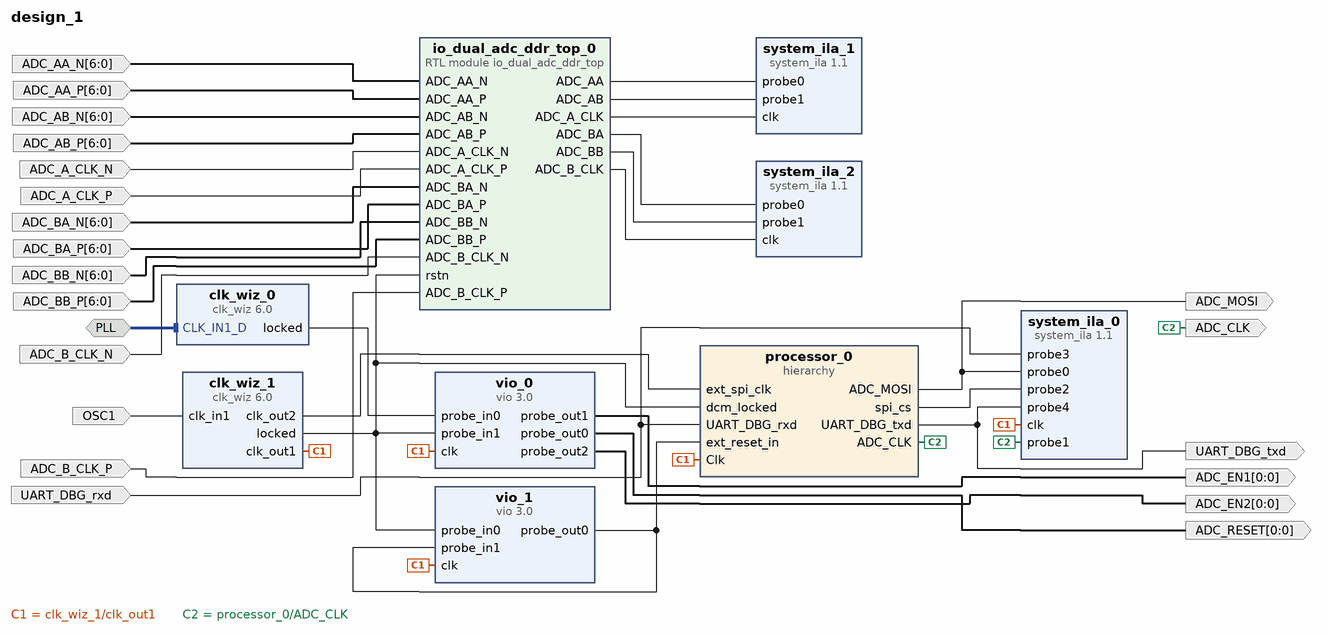
[diagram p0: block diagram of the top level]
# Vivado block design design_1, xcau10p-ffvb676-2-i, Vivado 2024.2
create_bd_design design_1

create_bd_intf_port -mode Slave -vlnv xilinx.com:interface:diff_clock_rtl:1.0 PLL
create_bd_port -dir O ADC_MOSI
create_bd_port -dir O ADC_CLK
create_bd_port -dir O -from 0 -to 0 ADC_RESET
create_bd_port -dir O -from 0 -to 0 ADC_EN1
create_bd_port -dir O -from 0 -to 0 ADC_EN2
create_bd_port -dir I -type clk OSC1
create_bd_port -dir I -from 6 -to 0 ADC_AA_N
create_bd_port -dir I -from 6 -to 0 ADC_AA_P
create_bd_port -dir I -from 6 -to 0 ADC_AB_N
create_bd_port -dir I -from 6 -to 0 ADC_AB_P
create_bd_port -dir I -type clk ADC_A_CLK_N
create_bd_port -dir I -type clk ADC_A_CLK_P
create_bd_port -dir I -from 6 -to 0 ADC_BA_N
create_bd_port -dir I -from 6 -to 0 ADC_BA_P
create_bd_port -dir I -from 6 -to 0 ADC_BB_N
create_bd_port -dir I -from 6 -to 0 ADC_BB_P
create_bd_port -dir I -type clk ADC_B_CLK_N
create_bd_port -dir I -type clk ADC_B_CLK_P
create_bd_port -dir I UART_DBG_rxd
create_bd_port -dir O UART_DBG_txd

create_bd_cell -type ip -vlnv xilinx.com:ip:system_ila:1.1 system_ila_0
set_property -dict [list \
  CONFIG.C_DATA_DEPTH 16384 \
  CONFIG.C_INPUT_PIPE_STAGES 2 \
  CONFIG.C_MON_TYPE NATIVE \
  CONFIG.C_NUM_OF_PROBES 5 \
] [get_bd_cells system_ila_0]
create_bd_cell -type ip -vlnv xilinx.com:ip:vio:3.0 vio_0
set_property -dict {CONFIG.C_NUM_PROBE_IN 2 CONFIG.C_NUM_PROBE_OUT 3} [get_bd_cells vio_0]
create_bd_cell -type ip -vlnv xilinx.com:ip:clk_wiz:6.0 clk_wiz_0
set_property -dict [list \
  CONFIG.CLKOUT1_DRIVES BUFG \
  CONFIG.CLKOUT1_JITTER 120.663 \
  CONFIG.CLKOUT1_REQUESTED_OUT_FREQ 80.000 \
  CONFIG.CLKOUT2_DRIVES BUFG \
  CONFIG.CLKOUT2_JITTER 139.033 \
  CONFIG.CLKOUT2_PHASE_ERROR 87.180 \
  CONFIG.CLKOUT2_REQUESTED_OUT_FREQ 40.000 \
  CONFIG.CLKOUT2_USED true \
  CONFIG.CLKOUT3_DRIVES BUFG \
  CONFIG.CLKOUT3_JITTER 162.167 \
  CONFIG.CLKOUT3_PHASE_ERROR 87.180 \
  CONFIG.CLKOUT3_REQUESTED_OUT_FREQ 20.000 \
  CONFIG.CLKOUT3_USED true \
  CONFIG.CLKOUT4_DRIVES BUFG \
  CONFIG.CLKOUT4_JITTER 162.167 \
  CONFIG.CLKOUT4_PHASE_ERROR 87.180 \
  CONFIG.CLKOUT4_REQUESTED_OUT_FREQ 20.000 \
  CONFIG.CLKOUT4_REQUESTED_PHASE 180.000 \
  CONFIG.CLKOUT4_USED true \
  CONFIG.CLK_OUT1_PORT clk_80 \
  CONFIG.CLK_OUT2_PORT clk_40 \
  CONFIG.CLK_OUT3_PORT clk_20 \
  CONFIG.CLK_OUT4_PORT clk_20n \
  CONFIG.FEEDBACK_SOURCE FDBK_AUTO \
  CONFIG.MMCM_CLKOUT0_DIVIDE_F 15.000 \
  CONFIG.MMCM_CLKOUT1_DIVIDE 30 \
  CONFIG.MMCM_CLKOUT2_DIVIDE 60 \
  CONFIG.MMCM_CLKOUT3_DIVIDE 60 \
  CONFIG.MMCM_CLKOUT3_PHASE 180.000 \
  CONFIG.NUM_OUT_CLKS 4 \
  CONFIG.PRIM_SOURCE Differential_clock_capable_pin \
  CONFIG.USE_RESET false \
] [get_bd_cells clk_wiz_0]
create_bd_cell -type hier processor_0
create_bd_cell -type module -reference io_dual_adc_ddr_top io_dual_adc_ddr_top_0
create_bd_cell -type ip -vlnv xilinx.com:ip:system_ila:1.1 system_ila_1
set_property -dict {CONFIG.C_DATA_DEPTH 8192 CONFIG.C_MON_TYPE NATIVE CONFIG.C_NUM_OF_PROBES 2} [get_bd_cells system_ila_1]
create_bd_cell -type ip -vlnv xilinx.com:ip:system_ila:1.1 system_ila_2
set_property -dict {CONFIG.C_DATA_DEPTH 8192 CONFIG.C_MON_TYPE NATIVE CONFIG.C_NUM_OF_PROBES 2} [get_bd_cells system_ila_2]
create_bd_cell -type ip -vlnv xilinx.com:ip:clk_wiz:6.0 clk_wiz_1
set_property -dict [list \
  CONFIG.AUTO_PRIMITIVE PLL \
  CONFIG.CLKOUT1_DRIVES BUFG \
  CONFIG.CLKOUT1_JITTER 144.719 \
  CONFIG.CLKOUT1_PHASE_ERROR 114.212 \
  CONFIG.CLKOUT2_DRIVES BUFG \
  CONFIG.CLKOUT2_JITTER 239.501 \
  CONFIG.CLKOUT2_PHASE_ERROR 114.212 \
  CONFIG.CLKOUT2_REQUESTED_OUT_FREQ 8.000 \
  CONFIG.CLKOUT2_USED true \
  CONFIG.CLKOUT3_DRIVES Buffer \
  CONFIG.CLKOUT4_DRIVES Buffer \
  CONFIG.CLKOUT5_DRIVES Buffer \
  CONFIG.CLKOUT6_DRIVES Buffer \
  CONFIG.CLKOUT7_DRIVES Buffer \
  CONFIG.FEEDBACK_SOURCE FDBK_AUTO \
  CONFIG.MMCM_BANDWIDTH OPTIMIZED \
  CONFIG.MMCM_CLKFBOUT_MULT_F 8 \
  CONFIG.MMCM_CLKOUT0_DIVIDE_F 8 \
  CONFIG.MMCM_CLKOUT1_DIVIDE 100 \
  CONFIG.MMCM_COMPENSATION AUTO \
  CONFIG.NUM_OUT_CLKS 2 \
  CONFIG.OPTIMIZE_CLOCKING_STRUCTURE_EN true \
  CONFIG.PRIMITIVE PLL \
  CONFIG.USE_LOCKED true \
  CONFIG.USE_RESET false \
] [get_bd_cells clk_wiz_1]
create_bd_cell -type ip -vlnv xilinx.com:ip:vio:3.0 vio_1
set_property -dict {CONFIG.C_NUM_PROBE_IN 2} [get_bd_cells vio_1]

# ---- hierarchy /processor_0 ----
current_bd_instance /processor_0
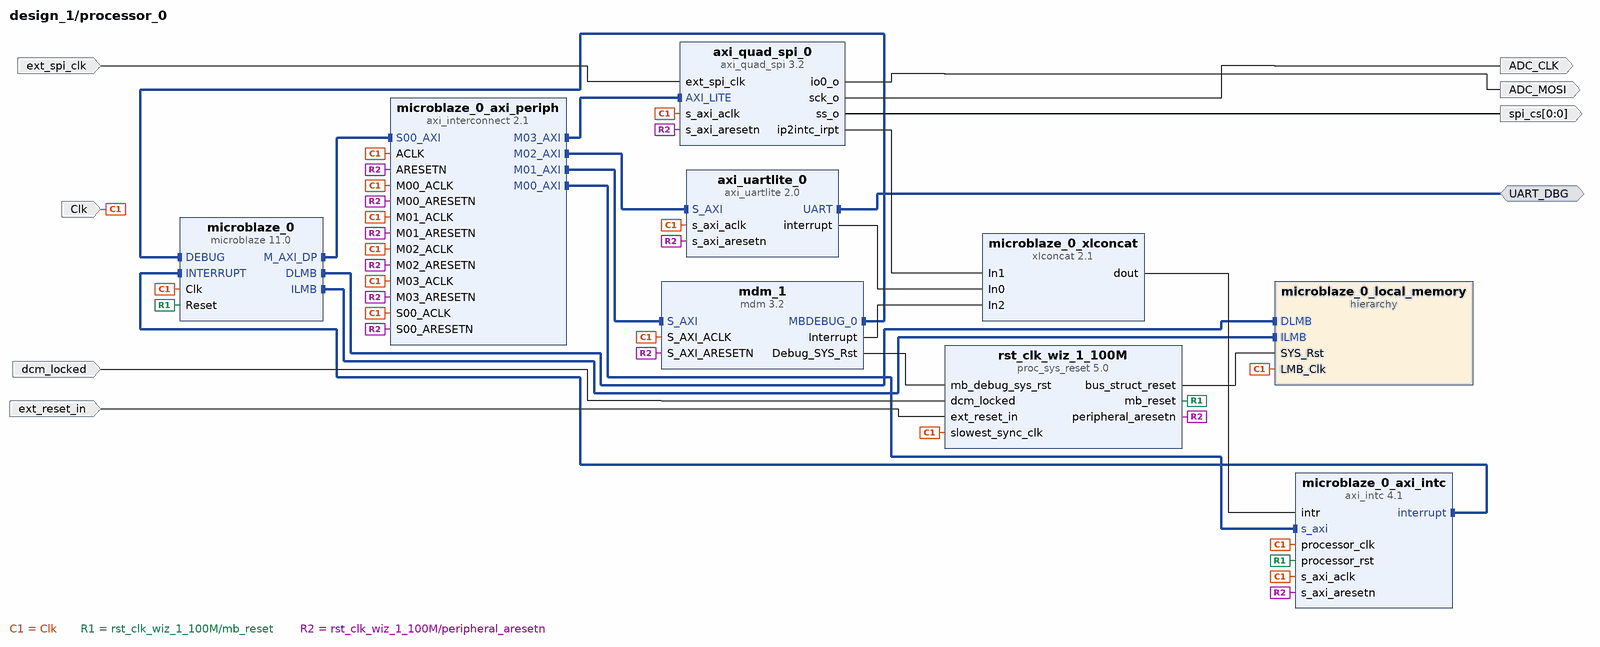
[diagram p1: block diagram inside /processor_0]
create_bd_intf_pin -mode Master -vlnv xilinx.com:interface:uart_rtl:1.0 UART_DBG
create_bd_pin -dir I -type clk Clk
create_bd_pin -dir I dcm_locked
create_bd_pin -dir I -type clk ext_spi_clk
create_bd_pin -dir O ADC_MOSI
create_bd_pin -dir O ADC_CLK
create_bd_pin -dir O -from 0 -to 0 spi_cs
create_bd_pin -dir I -type rst ext_reset_in

create_bd_cell -type ip -vlnv xilinx.com:ip:mdm:3.2 mdm_1
set_property -dict {CONFIG.C_ADDR_SIZE 32 CONFIG.C_M_AXI_ADDR_WIDTH 32 CONFIG.C_USE_UART 1} [get_bd_cells mdm_1]
create_bd_cell -type ip -vlnv xilinx.com:ip:axi_intc:4.1 microblaze_0_axi_intc
set_property -dict {CONFIG.C_HAS_FAST 1} [get_bd_cells microblaze_0_axi_intc]
create_bd_cell -type ip -vlnv xilinx.com:ip:xlconcat:2.1 microblaze_0_xlconcat
set_property -dict {CONFIG.NUM_PORTS 3} [get_bd_cells microblaze_0_xlconcat]
create_bd_cell -type ip -vlnv xilinx.com:ip:microblaze:11.0 microblaze_0
set_property -dict [list \
  CONFIG.C_DEBUG_ENABLED 1 \
  CONFIG.C_D_AXI 1 \
  CONFIG.C_D_LMB 1 \
  CONFIG.C_ENABLE_CONVERSION 0 \
  CONFIG.C_I_LMB 1 \
  CONFIG.G_TEMPLATE_LIST 8 \
] [get_bd_cells microblaze_0]
create_bd_cell -type ip -vlnv xilinx.com:ip:axi_uartlite:2.0 axi_uartlite_0
create_bd_cell -type ip -vlnv xilinx.com:ip:proc_sys_reset:5.0 rst_clk_wiz_1_100M
create_bd_cell -type ip -vlnv xilinx.com:ip:axi_quad_spi:3.2 axi_quad_spi_0
create_bd_cell -type ip -vlnv xilinx.com:ip:axi_interconnect:2.1 microblaze_0_axi_periph
set_property -dict {CONFIG.NUM_MI 4} [get_bd_cells microblaze_0_axi_periph]
create_bd_cell -type hier microblaze_0_local_memory

# ---- hierarchy /processor_0/microblaze_0_local_memory ----
current_bd_instance /processor_0/microblaze_0_local_memory
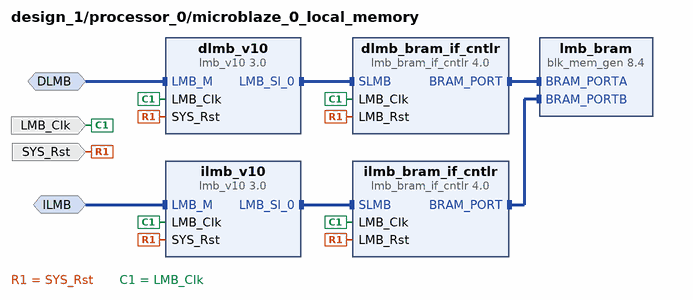
[diagram p2: block diagram inside /processor_0/microblaze_0_local_memory]
create_bd_intf_pin -mode MirroredMaster -vlnv xilinx.com:interface:lmb_rtl:1.0 DLMB
create_bd_intf_pin -mode MirroredMaster -vlnv xilinx.com:interface:lmb_rtl:1.0 ILMB
create_bd_pin -dir I -type clk LMB_Clk
create_bd_pin -dir I -type rst SYS_Rst

create_bd_cell -type ip -vlnv xilinx.com:ip:lmb_v10:3.0 dlmb_v10
create_bd_cell -type ip -vlnv xilinx.com:ip:lmb_v10:3.0 ilmb_v10
create_bd_cell -type ip -vlnv xilinx.com:ip:lmb_bram_if_cntlr:4.0 dlmb_bram_if_cntlr
set_property -dict {CONFIG.C_ECC 0} [get_bd_cells dlmb_bram_if_cntlr]
create_bd_cell -type ip -vlnv xilinx.com:ip:lmb_bram_if_cntlr:4.0 ilmb_bram_if_cntlr
set_property -dict {CONFIG.C_ECC 0} [get_bd_cells ilmb_bram_if_cntlr]
create_bd_cell -type ip -vlnv xilinx.com:ip:blk_mem_gen:8.4 lmb_bram
set_property -dict {CONFIG.Memory_Type True_Dual_Port_RAM CONFIG.use_bram_block BRAM_Controller} [get_bd_cells lmb_bram]

# ---- connections ----

current_bd_instance /processor_0
connect_bd_intf_net [get_bd_intf_pins UART_DBG] [get_bd_intf_pins axi_uartlite_0/UART]
connect_bd_intf_net -intf_net microblaze_0_axi_dp [get_bd_intf_pins microblaze_0_axi_periph/S00_AXI] [get_bd_intf_pins microblaze_0/M_AXI_DP]
connect_bd_intf_net [get_bd_intf_pins microblaze_0_axi_periph/M02_AXI] [get_bd_intf_pins axi_uartlite_0/S_AXI]
connect_bd_intf_net [get_bd_intf_pins microblaze_0_axi_periph/M03_AXI] [get_bd_intf_pins axi_quad_spi_0/AXI_LITE]
connect_bd_intf_net [get_bd_intf_pins mdm_1/MBDEBUG_0] [get_bd_intf_pins microblaze_0/DEBUG]
connect_bd_intf_net [get_bd_intf_pins microblaze_0/DLMB] [get_bd_intf_pins microblaze_0_local_memory/DLMB]
connect_bd_intf_net [get_bd_intf_pins microblaze_0/ILMB] [get_bd_intf_pins microblaze_0_local_memory/ILMB]
connect_bd_intf_net -intf_net microblaze_0_intc_axi [get_bd_intf_pins microblaze_0_axi_periph/M00_AXI] [get_bd_intf_pins microblaze_0_axi_intc/s_axi]
connect_bd_intf_net [get_bd_intf_pins microblaze_0_axi_intc/interrupt] [get_bd_intf_pins microblaze_0/INTERRUPT]
connect_bd_intf_net -intf_net microblaze_0_mdm_axi [get_bd_intf_pins microblaze_0_axi_periph/M01_AXI] [get_bd_intf_pins mdm_1/S_AXI]
connect_bd_net [get_bd_pins axi_quad_spi_0/io0_o] [get_bd_pins ADC_MOSI]
connect_bd_net [get_bd_pins axi_quad_spi_0/ip2intc_irpt] [get_bd_pins microblaze_0_xlconcat/In1]
connect_bd_net [get_bd_pins axi_quad_spi_0/sck_o] [get_bd_pins ADC_CLK]
connect_bd_net [get_bd_pins axi_quad_spi_0/ss_o] [get_bd_pins spi_cs]
connect_bd_net [get_bd_pins axi_uartlite_0/interrupt] [get_bd_pins microblaze_0_xlconcat/In0]
connect_bd_net -net clk_wiz_1_clk_out2 [get_bd_pins ext_spi_clk] [get_bd_pins axi_quad_spi_0/ext_spi_clk]
connect_bd_net -net clk_wiz_1_locked [get_bd_pins dcm_locked] [get_bd_pins rst_clk_wiz_1_100M/dcm_locked]
connect_bd_net [get_bd_pins ext_reset_in] [get_bd_pins rst_clk_wiz_1_100M/ext_reset_in]
connect_bd_net [get_bd_pins mdm_1/Interrupt] [get_bd_pins microblaze_0_xlconcat/In2]
connect_bd_net [get_bd_pins mdm_1/Debug_SYS_Rst] [get_bd_pins rst_clk_wiz_1_100M/mb_debug_sys_rst]
connect_bd_net -net microblaze_0_Clk [get_bd_pins Clk] \
  [get_bd_pins microblaze_0/Clk] [get_bd_pins microblaze_0_axi_periph/ACLK] [get_bd_pins microblaze_0_axi_periph/S00_ACLK] \
  [get_bd_pins microblaze_0_axi_periph/M00_ACLK] [get_bd_pins microblaze_0_axi_periph/M01_ACLK] \
  [get_bd_pins microblaze_0_axi_intc/s_axi_aclk] [get_bd_pins microblaze_0_axi_intc/processor_clk] \
  [get_bd_pins microblaze_0_local_memory/LMB_Clk] [get_bd_pins rst_clk_wiz_1_100M/slowest_sync_clk] \
  [get_bd_pins axi_uartlite_0/s_axi_aclk] [get_bd_pins microblaze_0_axi_periph/M02_ACLK] \
  [get_bd_pins axi_quad_spi_0/s_axi_aclk] [get_bd_pins microblaze_0_axi_periph/M03_ACLK] [get_bd_pins mdm_1/S_AXI_ACLK]
connect_bd_net -net microblaze_0_intr [get_bd_pins microblaze_0_xlconcat/dout] [get_bd_pins microblaze_0_axi_intc/intr]
connect_bd_net [get_bd_pins rst_clk_wiz_1_100M/bus_struct_reset] [get_bd_pins microblaze_0_local_memory/SYS_Rst]
connect_bd_net [get_bd_pins rst_clk_wiz_1_100M/mb_reset] [get_bd_pins microblaze_0/Reset] [get_bd_pins microblaze_0_axi_intc/processor_rst]
connect_bd_net [get_bd_pins rst_clk_wiz_1_100M/peripheral_aresetn] \
  [get_bd_pins microblaze_0_axi_periph/ARESETN] [get_bd_pins microblaze_0_axi_periph/S00_ARESETN] \
  [get_bd_pins microblaze_0_axi_periph/M00_ARESETN] [get_bd_pins microblaze_0_axi_periph/M01_ARESETN] \
  [get_bd_pins mdm_1/S_AXI_ARESETN] [get_bd_pins microblaze_0_axi_intc/s_axi_aresetn] \
  [get_bd_pins axi_uartlite_0/s_axi_aresetn] [get_bd_pins microblaze_0_axi_periph/M02_ARESETN] \
  [get_bd_pins axi_quad_spi_0/s_axi_aresetn] [get_bd_pins microblaze_0_axi_periph/M03_ARESETN]
set_property HDL_ATTRIBUTE.BMM_INFO_PROCESSOR {microblaze-le > design_1 processor_0/microblaze_0_local_memory/dlmb_bram_if_cntlr} [get_bd_cells microblaze_0]
set_property HDL_ATTRIBUTE.KEEP_HIERARCHY yes [get_bd_cells microblaze_0]

current_bd_instance /processor_0/microblaze_0_local_memory
connect_bd_intf_net -intf_net microblaze_0_dlmb [get_bd_intf_pins dlmb_v10/LMB_M] [get_bd_intf_pins DLMB]
connect_bd_intf_net -intf_net microblaze_0_dlmb_bus [get_bd_intf_pins dlmb_v10/LMB_Sl_0] [get_bd_intf_pins dlmb_bram_if_cntlr/SLMB]
connect_bd_intf_net -intf_net microblaze_0_dlmb_cntlr [get_bd_intf_pins dlmb_bram_if_cntlr/BRAM_PORT] [get_bd_intf_pins lmb_bram/BRAM_PORTA]
connect_bd_intf_net -intf_net microblaze_0_ilmb [get_bd_intf_pins ilmb_v10/LMB_M] [get_bd_intf_pins ILMB]
connect_bd_intf_net -intf_net microblaze_0_ilmb_bus [get_bd_intf_pins ilmb_v10/LMB_Sl_0] [get_bd_intf_pins ilmb_bram_if_cntlr/SLMB]
connect_bd_intf_net -intf_net microblaze_0_ilmb_cntlr [get_bd_intf_pins ilmb_bram_if_cntlr/BRAM_PORT] [get_bd_intf_pins lmb_bram/BRAM_PORTB]
connect_bd_net [get_bd_pins SYS_Rst] \
  [get_bd_pins dlmb_v10/SYS_Rst] [get_bd_pins dlmb_bram_if_cntlr/LMB_Rst] [get_bd_pins ilmb_v10/SYS_Rst] \
  [get_bd_pins ilmb_bram_if_cntlr/LMB_Rst]
connect_bd_net -net microblaze_0_Clk [get_bd_pins LMB_Clk] \
  [get_bd_pins dlmb_v10/LMB_Clk] [get_bd_pins dlmb_bram_if_cntlr/LMB_Clk] [get_bd_pins ilmb_v10/LMB_Clk] \
  [get_bd_pins ilmb_bram_if_cntlr/LMB_Clk]
set_property HDL_ATTRIBUTE.BMM_INFO_ADDRESS_SPACE {byte  0x00000000 32 > design_1 processor_0/microblaze_0_local_memory/lmb_bram} [get_bd_cells dlmb_bram_if_cntlr]
set_property HDL_ATTRIBUTE.KEEP_HIERARCHY yes [get_bd_cells dlmb_bram_if_cntlr]

current_bd_instance /
connect_bd_intf_net -intf_net CLK_IN1_D_0_1 [get_bd_intf_ports PLL] [get_bd_intf_pins clk_wiz_0/CLK_IN1_D]
connect_bd_net -net ADC_AA_N_0_1 [get_bd_ports ADC_AA_N] [get_bd_pins io_dual_adc_ddr_top_0/ADC_AA_N]
connect_bd_net -net ADC_AA_P_0_1 [get_bd_ports ADC_AA_P] [get_bd_pins io_dual_adc_ddr_top_0/ADC_AA_P]
connect_bd_net -net ADC_AB_N_0_1 [get_bd_ports ADC_AB_N] [get_bd_pins io_dual_adc_ddr_top_0/ADC_AB_N]
connect_bd_net -net ADC_AB_P_0_1 [get_bd_ports ADC_AB_P] [get_bd_pins io_dual_adc_ddr_top_0/ADC_AB_P]
connect_bd_net -net ADC_A_CLK_N_0_1 [get_bd_ports ADC_A_CLK_N] [get_bd_pins io_dual_adc_ddr_top_0/ADC_A_CLK_N]
connect_bd_net -net ADC_A_CLK_P_0_1 [get_bd_ports ADC_A_CLK_P] [get_bd_pins io_dual_adc_ddr_top_0/ADC_A_CLK_P]
connect_bd_net -net ADC_BA_N_0_1 [get_bd_ports ADC_BA_N] [get_bd_pins io_dual_adc_ddr_top_0/ADC_BA_N]
connect_bd_net -net ADC_BA_P_0_1 [get_bd_ports ADC_BA_P] [get_bd_pins io_dual_adc_ddr_top_0/ADC_BA_P]
connect_bd_net -net ADC_BB_N_0_1 [get_bd_ports ADC_BB_N] [get_bd_pins io_dual_adc_ddr_top_0/ADC_BB_N]
connect_bd_net -net ADC_BB_P_0_1 [get_bd_ports ADC_BB_P] [get_bd_pins io_dual_adc_ddr_top_0/ADC_BB_P]
connect_bd_net -net ADC_B_CLK_N_0_1 [get_bd_ports ADC_B_CLK_N] [get_bd_pins io_dual_adc_ddr_top_0/ADC_B_CLK_N]
connect_bd_net -net ADC_B_CLK_P_0_1 [get_bd_ports ADC_B_CLK_P] [get_bd_pins io_dual_adc_ddr_top_0/ADC_B_CLK_P]
connect_bd_net [get_bd_pins clk_wiz_1/clk_out1] \
  [get_bd_pins system_ila_0/clk] [get_bd_pins vio_0/clk] [get_bd_pins processor_0/Clk] [get_bd_pins vio_1/clk]
connect_bd_net -net OSC1_1 [get_bd_ports OSC1] [get_bd_pins clk_wiz_1/clk_in1]
connect_bd_net [get_bd_ports UART_DBG_rxd] [get_bd_pins system_ila_0/probe3] [get_bd_pins processor_0/UART_DBG_rxd]
connect_bd_net -net axi_quad_spi_0_io0_o [get_bd_pins processor_0/ADC_MOSI] [get_bd_ports ADC_MOSI] [get_bd_pins system_ila_0/probe0]
connect_bd_net -net axi_quad_spi_0_sck_o [get_bd_pins processor_0/ADC_CLK] [get_bd_ports ADC_CLK] [get_bd_pins system_ila_0/probe1]
connect_bd_net -net axi_quad_spi_0_ss_o [get_bd_pins processor_0/spi_cs] [get_bd_pins system_ila_0/probe2]
connect_bd_net [get_bd_pins clk_wiz_0/locked] [get_bd_pins vio_0/probe_in0]
connect_bd_net [get_bd_pins clk_wiz_1/clk_out2] [get_bd_pins processor_0/ext_spi_clk]
connect_bd_net [get_bd_pins clk_wiz_1/locked] \
  [get_bd_pins processor_0/dcm_locked] [get_bd_pins io_dual_adc_ddr_top_0/rstn] [get_bd_pins vio_0/probe_in1] \
  [get_bd_pins vio_1/probe_in0]
connect_bd_net [get_bd_pins io_dual_adc_ddr_top_0/ADC_AA] [get_bd_pins system_ila_1/probe0]
connect_bd_net [get_bd_pins io_dual_adc_ddr_top_0/ADC_AB] [get_bd_pins system_ila_1/probe1]
connect_bd_net [get_bd_pins io_dual_adc_ddr_top_0/ADC_A_CLK] [get_bd_pins system_ila_1/clk]
connect_bd_net [get_bd_pins io_dual_adc_ddr_top_0/ADC_BA] [get_bd_pins system_ila_2/probe0]
connect_bd_net [get_bd_pins io_dual_adc_ddr_top_0/ADC_BB] [get_bd_pins system_ila_2/probe1]
connect_bd_net [get_bd_pins io_dual_adc_ddr_top_0/ADC_B_CLK] [get_bd_pins system_ila_2/clk]
connect_bd_net [get_bd_pins processor_0/UART_DBG_txd] [get_bd_pins system_ila_0/probe4] [get_bd_ports UART_DBG_txd]
connect_bd_net [get_bd_pins vio_0/probe_out0] [get_bd_ports ADC_RESET]
connect_bd_net [get_bd_pins vio_0/probe_out1] [get_bd_ports ADC_EN1]
connect_bd_net [get_bd_pins vio_0/probe_out2] [get_bd_ports ADC_EN2]
connect_bd_net [get_bd_pins vio_1/probe_out0] [get_bd_pins processor_0/ext_reset_in] [get_bd_pins vio_1/probe_in1]

# ---- address map ----
assign_bd_address -offset 0x00000000 -range 128K -target_address_space [get_bd_addr_spaces processor_0/microblaze_0/Data] [get_bd_addr_segs processor_0/microblaze_0_local_memory/dlmb_bram_if_cntlr/SLMB/Mem]
assign_bd_address -offset 0x40600000 -range 64K -target_address_space [get_bd_addr_spaces processor_0/microblaze_0/Data] [get_bd_addr_segs processor_0/axi_uartlite_0/S_AXI/Reg]
assign_bd_address -offset 0x41200000 -range 64K -target_address_space [get_bd_addr_spaces processor_0/microblaze_0/Data] [get_bd_addr_segs processor_0/microblaze_0_axi_intc/S_AXI/Reg]
assign_bd_address -offset 0x41400000 -range 4K -target_address_space [get_bd_addr_spaces processor_0/microblaze_0/Data] [get_bd_addr_segs processor_0/mdm_1/S_AXI/Reg]
assign_bd_address -offset 0x44A00000 -range 64K -target_address_space [get_bd_addr_spaces processor_0/microblaze_0/Data] [get_bd_addr_segs processor_0/axi_quad_spi_0/AXI_LITE/Reg]
assign_bd_address -offset 0x00000000 -range 128K -target_address_space [get_bd_addr_spaces processor_0/microblaze_0/Instruction] [get_bd_addr_segs processor_0/microblaze_0_local_memory/ilmb_bram_if_cntlr/SLMB/Mem]

validate_bd_design
save_bd_design
